# Altium schematic sheet USB.SchDoc
size A4
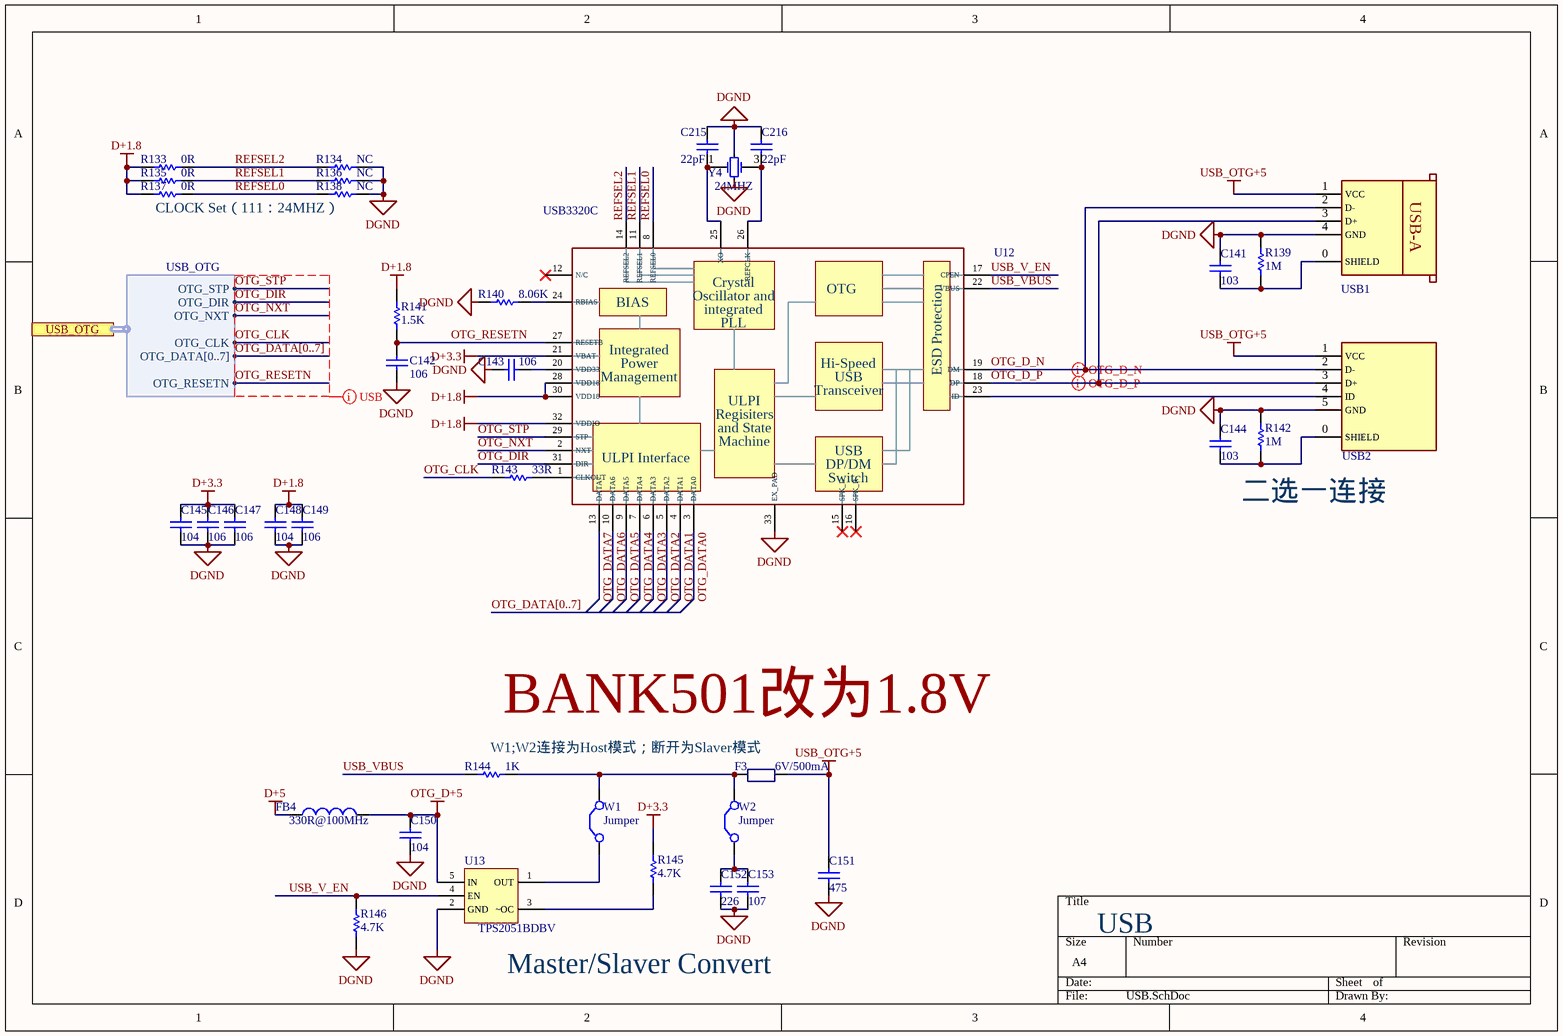
[diagram p0: USB.SchDoc]

## Parts
C141  103  [C 0603_L]
C142  106  [C 0603_L]
C143  106  [C 0603_L]
C144  103  [C 0603_L]
C145  104  [C 0402_LL]
C146  106  [C 0603_L]
C147  106  [C 0603_L]
C148  104  [C 0402_LL]
C149  106  [C 0603_L]
C150  104  [C 0402_LL]
C151  475  [C 0805_L]
C152  226  [C 0805_L]
C153  107  [C 1206_L]
C215  22pF  [C 0603_L]
C216  22pF  [C 0603_L]
F3  6V/500mA  [FU 0805]
FB4  value 330R@100MHz  [L 0805]  (hidden comment: Ferrite Bead)
R133  0R  [R 0402_L]
R134  NC  [R 0402_L]
R135  0R  [R 0402_L]
R136  NC  [R 0402_L]
R137  0R  [R 0402_L]
R138  NC  [R 0402_L]
R139  1M  [R 0603_L]
R140  8.06K  [R 0603_L]
R141  1.5K  [R 0603_L]
R142  1M  [R 0603_L]
R143  33R  [R 0603_L]
R144  1K  [R 0603_L]
R145  4.7K  [R 0603_L]
R146  4.7K  [R 0603_L]
U12  USB3320C  [QFN32 5x5_M]
U13  TPS2051BDBV  [SOT23-5N]
USB1  USB_A,B/S  [USB-A/S_A]  (value not drawn)
USB2  USB_miniB,microB  [USB-MINI-A]  (value not drawn)
W1  Jumper  [HDR2.54-LI-2P]
W2  Jumper  [HDR2.54-LI-2P]
Y4  24MHZ  [OSC 5032-4P]

## Ports
USB_OTG (harness USB_OTG)

## Harnesses
USB_OTG: OTG_STP, OTG_DIR, OTG_NXT, OTG_CLK, OTG_DATA[0..7], OTG_RESETN

## Nets
D+1.8: C148.1 C149.1 R133.2 R135.2 R137.2 R141.2 U12.28(VDD18) U12.30(VDD18) U12.32(VDDIO)
D+3.3: C145.1 C146.1 C147.1 R145.2 U12.21(VBAT)
D+5: FB4.1
DGND: C141.1 C142.2 C143.2 C144.1 C145.2 C146.2 C147.2 C148.2 C149.2 C150.2 C151.2 C152.2 C153.2 C215.1 C216.1 R134.1 R136.1 R138.1 R139.2 R140.1 R142.2 R146.1 U12.33(EX_PAD) U13.2(GND) USB1.4(GND) USB2.5(GND) Y4.2 Y4.4
OTG_D+5: C150.1 FB4.2 U13.5(IN)
USB_OTG+5: C151.1 F3.1 USB1.1(VCC) USB2.1(VCC)
OTG_CLK: R143.1 ; port USB_OTG.OTG_CLK
OTG_D_N: U12.19(DM) USB1.2(D-) USB2.2(D-)
OTG_D_P: U12.18(DP) USB1.3(D+) USB2.3(D+)
OTG_DATA0: U12.3(DATA0)
OTG_DATA1: U12.4(DATA1)
OTG_DATA2: U12.5(DATA2)
OTG_DATA3: U12.6(DATA3)
OTG_DATA4: U12.7(DATA4)
OTG_DATA5: U12.9(DATA5)
OTG_DATA6: U12.10(DATA6)
OTG_DATA7: U12.13(DATA7)
OTG_DIR: U12.31(DIR) ; port USB_OTG.OTG_DIR
OTG_NXT: U12.2(NXT) ; port USB_OTG.OTG_NXT
OTG_RESETN: C142.1 R141.1 U12.27(RESETB) ; port USB_OTG.OTG_RESETN
OTG_STP: U12.29(STP) ; port USB_OTG.OTG_STP
REFSEL0: R137.1 R138.2 U12.8(REFSEL0)
REFSEL1: R135.1 R136.2 U12.11(REFSEL1)
REFSEL2: R133.1 R134.2 U12.14(REFSEL2)
USB_V_EN: R146.2 U12.17(CPEN) U13.4(EN)
USB_VBUS: R144.2 U12.22(VBUS)
NetC141_2: C141.2 R139.1 USB1.0(SHIELD)
NetC143_1: C143.1 U12.20(VDD33)
NetC144_2: C144.2 R142.1 USB2.0(SHIELD)
NetC152_1: C152.1 C153.1 W2.1(C1)
NetC215_2: C215.2 U12.25(XO) Y4.1(OSC1)
NetC216_2: C216.2 U12.26(REFCLK) Y4.3(OSC2)
NetF3_2: F3.2 R144.1 W1.2(C2) W2.2(C2)
NetR140_2: R140.2 U12.24(RBIAS)
NetR143_2: R143.2 U12.1(CLKOUT)
NetR145_1: R145.1 U13.3(~OC)
NetU12_23: U12.23(ID) USB2.4(ID)
NetU13_1: U13.1(OUT) W1.1(C1)

Not connected (* = marked no-connect by the designer): U12 12(N/C)* 15(SPK_L)* 16(SPK_R)*

## Buses and harness runs
bus OTG_DATA[0..7]

## Layout directives
differential pair; differential pair class OTG_DATA: OTG_D_N, OTG_D_P
net class USB: OTG_CLK, OTG_DATA[0..7], OTG_DIR, OTG_NXT, OTG_RESETN, OTG_STP

## Notes on the sheet
- CLOCK Set（111：24MHZ）
- 二选一连接
- BANK501改为1.8V
- W1;W2连接为Host模式；断开为Slaver模式
- USB
- Master/Slaver Convert
- (in symbol USB3320C_re) Crystal; OTG; Oscillator and; BIAS; integrated; PLL; ESD Protection; Integrated; Power; Hi-Speed; Management; USB; Transceiver; ULPI; Regisiters; and State; Machine; ULPI Interface; DP/DM; Switch
- (in symbol USB_A,B/S) USB-A

## Library data of the parts
C141-C153 C215 C216 = Cap: Capacitor; Published: 8-Jun-2000; LatestRevisionDate: 17-Jul-2002; LatestRevisionNote: Re-released for DXP Platform.; PackageReference: RAD-0.3; Publisher: Altium Limited; PackageDescription: Radial Cap, Thru-Hole; 2 Leads; 0.3 in Pin Spacing
F3 = PTC
FB4 = Inductor: Code_IEC: 1005; Published: 8-Jun-2000; LatestRevisionDate: 29-May-2009; LatestRevisionNote: IPC-7351 Footprint Added.; PackageReference: 0402-A; Publisher: Altium Limited; PackageDescription: Chip Inductor; Code_JEITA: 0402
R133-R143 R145 R146 = Res1: Resistor; Value: 1K; Published: 8-Jun-2000; LatestRevisionDate: 17-Jul-2002; LatestRevisionNote: Re-released for DXP Platform.; PackageReference: AXIAL-0.3; Publisher: Altium Limited; PackageDescription: Axial Device, Thru-Hole; 2 Leads; 0.3 in Pin Spacing
R144 = Res1: Resistor; Published: 8-Jun-2000; LatestRevisionDate: 17-Jul-2002; LatestRevisionNote: Re-released for DXP Platform.; PackageReference: AXIAL-0.3; Publisher: Altium Limited; PackageDescription: Axial Device, Thru-Hole; 2 Leads; 0.3 in Pin Spacing; Value: 1K
U12 = USB3320C_re: USB PHY
U13 = TPS2051BDBV: Current-Limited, Power-Distribution Switches
W1 W2 = Jumper: Jumper Wire; Published: 24-Mar-1999; LatestRevisionDate: 17-Jul-2002; LatestRevisionNote: Re-released for DXP Platform.; PackageReference: RAD-0.2; Publisher: Altium Limited; PackageDescription: Radial Cap, Thru-Hole; 2 Leads; 0.2 in Pin Spacing
Y4 = XTAL-4-N: 无源晶振; Manufacturer: NC; value: 25MHZ